# EAGLE design TobiEncAS5600 (EAGLE 8.5.2)
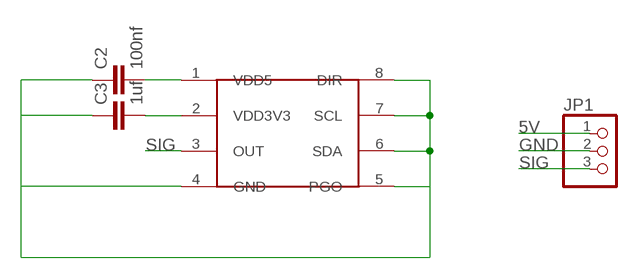
[diagram p0: schematic, sheet 1]

## Parts
C2  100nf  CAP0603-CAP  [0603-CAP]
C3  1uf  CAP0603-CAP  [0603-CAP]
JP1  PINHD-1X3  [1X03]
U$1  AS5600  [SO08]

## Nets
5V: C2.2 JP1.1 U$1.1(VDD5)
GND: C2.1 C3.1 JP1.2 U$1.4(GND) U$1.5(PGO) U$1.6(SDA) U$1.7(SCL) U$1.8(DIR)
SIG: JP1.3 U$1.3(OUT)
VDD3V3: C3.2 U$1.2(VDD3V3)

## Library data of the parts
C2 C3 = SparkFun-Capacitors:CAP: Capacitor Standard 0603 ceramic capacitor, and 0.1" leaded capacitor.
JP1 = pinhead:PINHD-1X3: PIN HEADER
U$1 = Gavin:AS5600

## Board
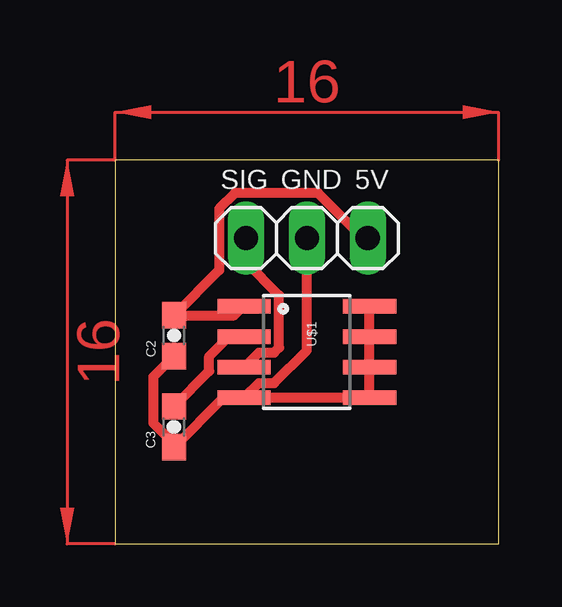
[diagram p1: board, top side]

Size 16 x 16 mm. Coordinates in mm from the lower left corner, seen from the top.
Outline: 0,0 16,0 16,16 0,16 0,0
Copper layers (1*16): Top 0.035mm / dielectric 1.5mm / Bottom 0.035mm
Design rules "default": minimum track width 6mil, minimum drill 0.35mm, track to track 6mil, track to pad 6mil, pad to pad 6mil, via to via 6mil, smd to smd 6mil, copper to edge 40mil, drill to drill 6mil, minimum pad ring 10mil, minimum via ring 8mil, stop-mask expansion 4mil, vias tented up to drill 0mil, thermal gap 10mil

### Footprints (pad centres in the part's own frame; a part is rotated, then mirrored left to right if it is on the bottom)
0603-CAP = smd 1.1 x 1: 1 -0.85,0; 2 0.85,0
1X03 = drill 1.016 long: 1 -2.54,0; 2 0,0; 3 2.54,0
SO08 = smd 0.61 x 2.21: 1 -1.905,-2.616; 2 -0.635,-2.616; 3 0.635,-2.616; 4 1.905,-2.616; 5 1.905,2.616; 6 0.635,2.616; 7 -0.635,2.616; 8 -1.905,2.616

### Placement (x,y rotation side)
C2  2.46,8.68 90 top
C3  2.45,4.88 90 top
JP1  8,12.75 180 top
U$1  8,8 270 top

### Tracks (layer width: path | path; a pad name or v marks a point on that pad's centre or on a via)
5V
  Top 0.152: 2.57,9.57 C2.2 | 5.32,9.88 U$1.1
  Top 0.406: 5.32,9.88 4.97,9.53 C2.2 4.34,11.41 4.34,13.97 5,14.63 8.46,14.63 10.34,12.75 JP1.1
GND
  Top 0.406: U$1.4 5.99,6.7 6.64,6.7 8,8.07 JP1.2 | U$1.4 U$1.5 U$1.6 U$1.7 U$1.8 | U$1.4 4.52,6.09 C3.1 2.45,4.18 1.59,5.03 1.59,6.96 C2.1
SIG
  Top 0.406: JP1.3 5.46,11.74 6.84,10.36 6.84,8.18 6.64,7.97 5.99,7.97 U$1.3
VDD3V3
  Top 0.152: 4.71,8.51 5.32,8.51 U$1.2 | 2.57,5.76 C3.2
  Top 0.406: C3.2 3.92,7.2 3.92,7.82 4.74,8.64 U$1.2
(copper drawn outside any net)
  shapes: Top area x2

### Text on the board
tPlace: SIG | GND | 5V